# EAGLE design kinesis-model-110 (EAGLE 9.6.2)
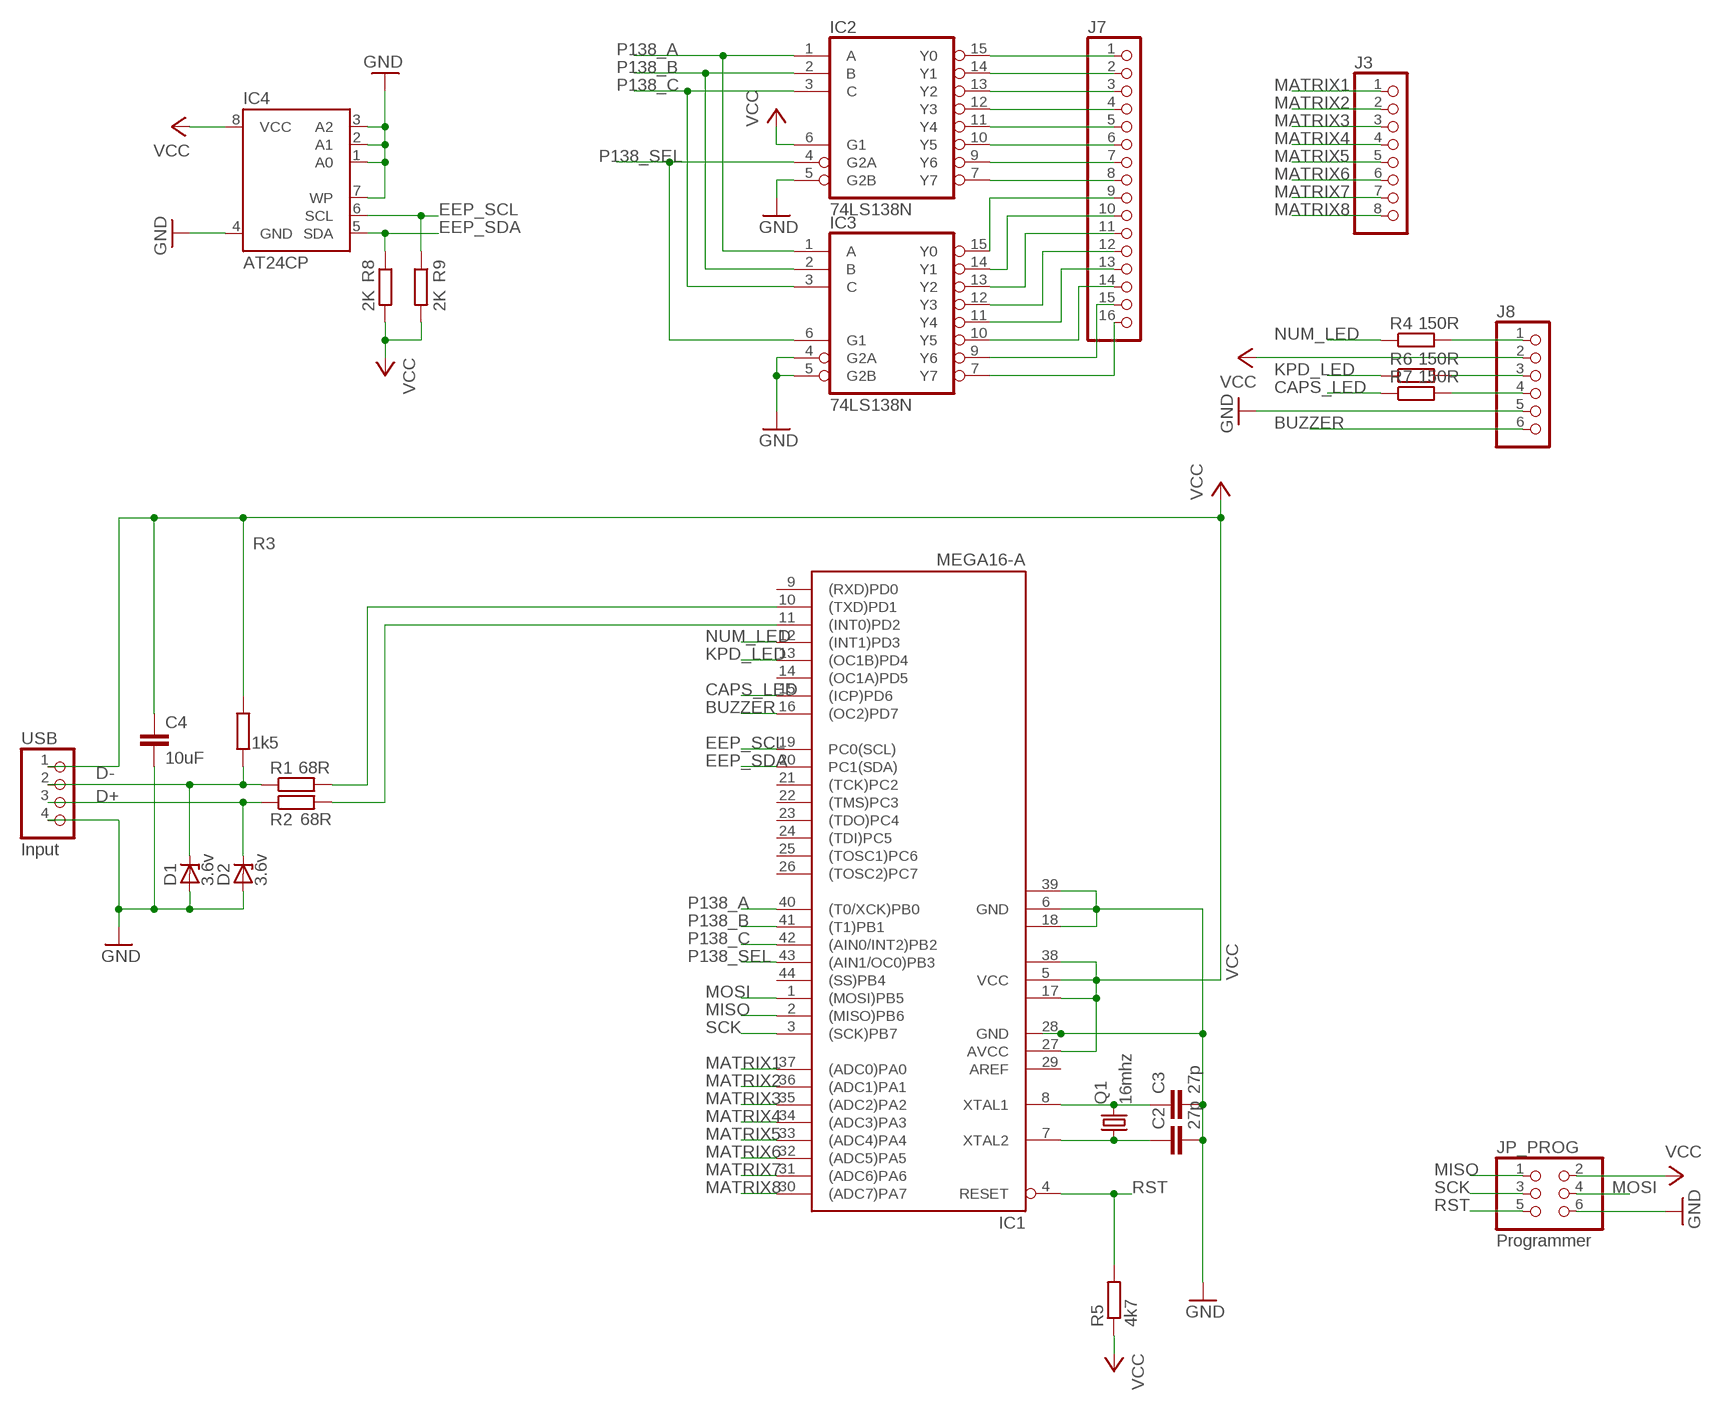
[diagram p0: schematic, sheet 1]

## Parts
C2  27p  C-EUC0603  [C0603]
C3  27p  C-EUC0603  [C0603]
C4  10uF  C-EUC0805  [C0805]
D1  3.6v  ZENER-DIODESOD80C  [SOD80C]
D2  3.6v  ZENER-DIODESOD80C  [SOD80C]
IC1  MEGA16-A  [TQFP44]
IC2  74LS138N  [DIL16]
IC3  74LS138N  [DIL16]
IC4  AT24CP  [DIL08]
J3  PINHD-1X8  [1X08]
J7  PINHD-1X16  [1X16]
J8  PINHD-1X6  [1X06]
JP_PROG  Programmer  PINHD-2X3  [2X03]
Q1  16mhz  CRYSTALHC49S  [HC49/S]
R1  68R  R-EU_R0603  [R0603]
R2  68R  R-EU_R0603  [R0603]
R3  1k5  R-EU_R0603  [R0603]
R4  150R  R-EU_R0603  [R0603]
R5  4k7  R-EU_R0603  [R0603]
R6  150R  R-EU_R0603  [R0603]
R7  150R  R-EU_R0603  [R0603]
R8  2K  R-EU_R0603  [R0603]
R9  2K  R-EU_R0603  [R0603]
USB  Input  PINHD-1X4  [1X04]

## Nets
BUZZER: IC1.16((OC2)PD7) J8.6
CAPS_LED: IC1.15((ICP)PD6) R7.1
CHIP-D+: IC1.11((INT0)PD2) R2.2
CHIP-D-: IC1.10((TXD)PD1) R1.2
D+: D2.C R2.1 USB.3
D-: D1.C R1.1 R3.1 USB.2
EEP_SCL: IC1.19(PC0(SCL)) IC4.6(SCL) R9.1
EEP_SDA: IC1.20(PC1(SDA)) IC4.5(SDA) R8.1
GND: C2.2 C3.2 C4.2 D1.A D2.A IC1.6(GND) IC1.18(GND1) IC1.28(GND) IC1.39(GND2) IC2.5(G2B) IC3.4(G2A) IC3.5(G2B) IC4.1(A0) IC4.2(A1) IC4.3(A2) IC4.4(GND) IC4.7(WP) J8.5 JP_PROG.6 USB.4
KPD_LED: IC1.13((OC1B)PD4) R6.1
MATRIX1: IC1.37((ADC0)PA0) J3.1
MATRIX2: IC1.36((ADC1)PA1) J3.2
MATRIX3: IC1.35((ADC2)PA2) J3.3
MATRIX4: IC1.34((ADC3)PA3) J3.4
MATRIX5: IC1.33((ADC4)PA4) J3.5
MATRIX6: IC1.32((ADC5)PA5) J3.6
MATRIX7: IC1.31((ADC6)PA6) J3.7
MATRIX8: IC1.30((ADC7)PA7) J3.8
MISO: IC1.2((MISO)PB6) JP_PROG.1
MOSI: IC1.1((MOSI)PB5) JP_PROG.4
N$1: IC2.15(Y0) J7.1
N$2: IC2.14(Y1) J7.2
N$3: IC2.13(Y2) J7.3
N$4: IC2.12(Y3) J7.4
N$5: IC2.11(Y4) J7.5
N$6: IC2.10(Y5) J7.6
N$7: IC2.9(Y6) J7.7
N$8: IC2.7(Y7) J7.8
N$9: IC3.15(Y0) J7.9
N$10: IC3.14(Y1) J7.10
N$11: IC3.13(Y2) J7.11
N$12: IC3.12(Y3) J7.12
N$13: IC3.11(Y4) J7.13
N$14: IC3.10(Y5) J7.14
N$15: IC3.9(Y6) J7.15
N$16: IC3.7(Y7) J7.16
N$17: J8.1 R4.2
N$19: J8.3 R6.2
N$20: J8.4 R7.2
NUM_LED: IC1.12((INT1)PD3) R4.1
P138_A: IC1.40((T0/XCK)PB0) IC2.1(A) IC3.1(A)
P138_B: IC1.41((T1)PB1) IC2.2(B) IC3.2(B)
P138_C: IC1.42((AIN0/INT2)PB2) IC2.3(C) IC3.3(C)
P138_SEL: IC1.43((AIN1/OC0)PB3) IC2.4(G2A) IC3.6(G1)
PIN9: C2.1 IC1.7(XTAL2) Q1.1
PIN10: C3.1 IC1.8(XTAL1) Q1.2
RST: IC1.4(RESET) JP_PROG.5 R5.2
SCK: IC1.3((SCK)PB7) JP_PROG.3
VCC: C4.1 IC1.5(VCC) IC1.17(VCC1) IC1.27(AVCC) IC1.38(VCC2) IC2.6(G1) IC4.8(VCC) J8.2 JP_PROG.2 R3.2 R5.1 R8.2 R9.2 USB.1
Unconnected: IC1.9((RXD)PD0) IC1.14((OC1A)PD5) IC1.21((TCK)PC2) IC1.22((TMS)PC3) IC1.23((TDO)PC4) IC1.24((TDI)PC5) IC1.25((TOSC1)PC6) IC1.26((TOSC2)PC7) IC1.29(AREF) IC1.44((SS)PB4)

## Power pins joined to a net without a drawn wire
GND: IC2.8(GND) IC3.8(GND)
VCC: IC2.16(VCC) IC3.16(VCC)

## Library data of the parts
C2-C4 = rcl:C-EU: CAPACITOR, European symbol
D1 D2 = diode:ZENER-DIODE: Z-Diode
IC1 = atmel:MEGA16: MICROCONTROLLER 16 Kbytes FLASH 1 kbytes SRAM 512 bytes EEPROM USART 8-channel 10 bit ADC Source: avr.lbr; MPN: ATMEGA16-16AU; OC_FARNELL: 9171134; OC_NEWARK: 96K6515
IC2 IC3 = 74xx-eu:74*138: 3-line to 8-line DECODER/DEMULTIPLEXER
IC4 = atmel:AT24C*: 2-wire serial EEPROM; MPN: AT24C1024BW-SH-B; OC_FARNELL: 1362646; OC_NEWARK: 03P2044
J3 = pinhead:PINHD-1X8: PIN HEADER
J7 = pinhead:PINHD-1X16: PIN HEADER
J8 = pinhead:PINHD-1X6: PIN HEADER
JP_PROG = pinhead:PINHD-2X3: PIN HEADER
Q1 = crystal:CRYSTAL: CRYSTAL; OC_FARNELL: 1667008; OC_NEWARK: unknown
R1-R9 = rcl:R-EU_: RESISTOR, European symbol
USB = pinhead:PINHD-1X4: PIN HEADER

## Board
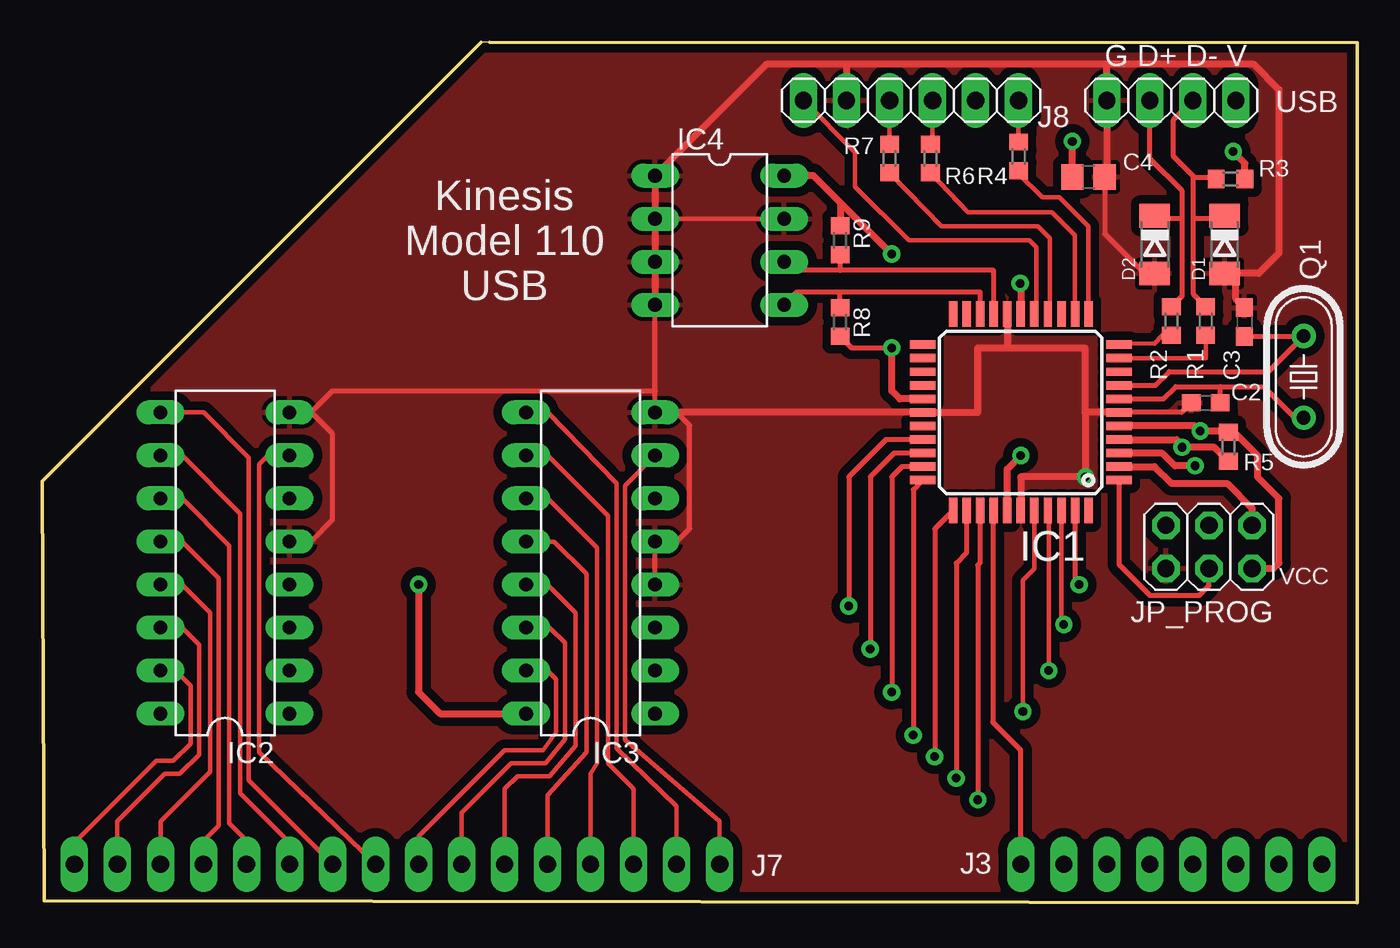
[diagram p1: board, top side]
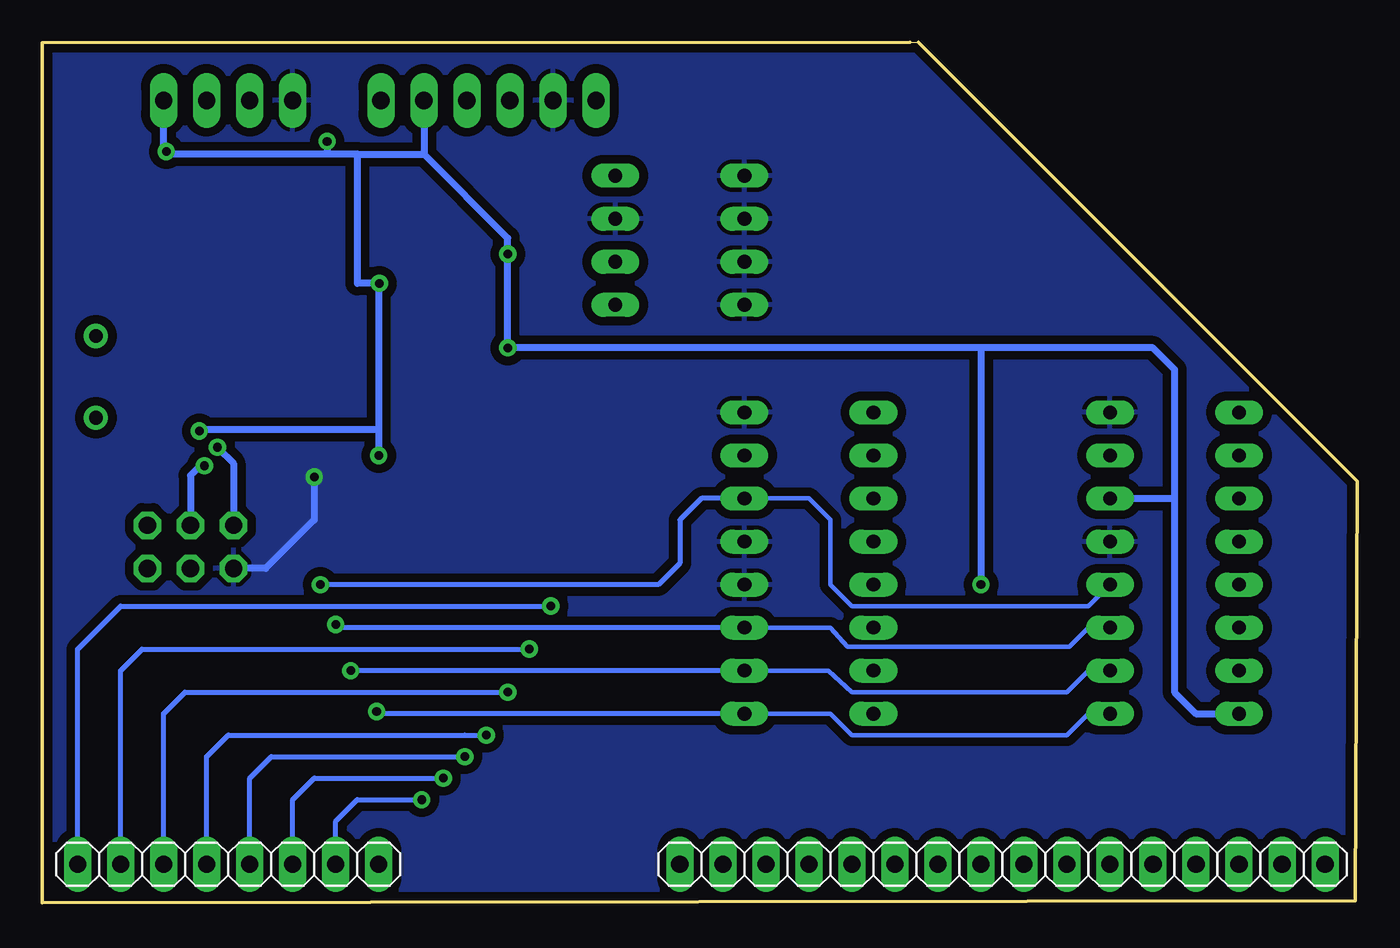
[diagram p2: board, bottom side, seen from below]

Size 77.64 x 50.8 mm. Coordinates in mm from the lower left corner, seen from the top.
Outline: 0.12,0.13 77.64,0 77.64,50.79 26.41,50.8 25.91,50.8 0,24.89 0.12,0.13
Copper layers (1*16): Top 0.035mm / dielectric 1.5mm / Bottom 0.035mm
Design rules "SparkFun": minimum track width 8mil, minimum drill 20mil, track to track 8mil, track to pad 8mil, pad to pad 8mil, via to via 8mil, smd to smd 8mil, copper to edge 10mil, drill to drill 8mil, minimum pad ring 12mil, minimum via ring 10mil, stop-mask expansion 4mil, vias tented up to drill 25mil, thermal gap 10mil

### Footprints (pad centres in the part's own frame; a part is rotated, then mirrored left to right if it is on the bottom)
C0603 = smd 1.1 x 1: 1 -0.85,0; 2 0.85,0
C0805 = smd 1.3 x 1.5: 1 -0.95,0; 2 0.95,0
SOD80C = smd 1.4 x 1.8: A 1.7,0; C -1.7,0
TQFP44 = smd 1.5 x 0.5: 1 -5.8,4; 2 -5.8,3.2; 3 -5.8,2.4; 4 -5.8,1.6; 5 -5.8,0.8; 6 -5.8,0; 7 -5.8,-0.8; 8 -5.8,-1.6; 9 -5.8,-2.4; 10 -5.8,-3.2; 11 -5.8,-4; 23 5.8,-4; 24 5.8,-3.2; 25 5.8,-2.4; 26 5.8,-1.6; 27 5.8,-0.8; 28 5.8,0; 29 5.8,0.8; 30 5.8,1.6; 31 5.8,2.4; 32 5.8,3.2; 33 5.8,4 | smd 0.5 x 1.5: 12 -4,-5.8; 13 -3.2,-5.8; 14 -2.4,-5.8; 15 -1.6,-5.8; 16 -0.8,-5.8; 17 0,-5.8; 18 0.8,-5.8; 19 1.6,-5.8; 20 2.4,-5.8; 21 3.2,-5.8; 22 4,-5.8; 34 4,5.8; 35 3.2,5.8; 36 2.4,5.8; 37 1.6,5.8; 38 0.8,5.8; 39 0,5.8; 40 -0.8,5.8; 41 -1.6,5.8; 42 -2.4,5.8; 43 -3.2,5.8; 44 -4,5.8
DIL16 = drill 0.813 long: 1 -8.89,-3.81; 2 -6.35,-3.81; 3 -3.81,-3.81; 4 -1.27,-3.81; 5 1.27,-3.81; 6 3.81,-3.81; 7 6.35,-3.81; 8 8.89,-3.81; 9 8.89,3.81; 10 6.35,3.81; 11 3.81,3.81; 12 1.27,3.81; 13 -1.27,3.81; 14 -3.81,3.81; 15 -6.35,3.81; 16 -8.89,3.81
DIL08 = drill 0.813 long: 1 -3.81,-3.81; 2 -1.27,-3.81; 3 1.27,-3.81; 4 3.81,-3.81; 5 3.81,3.81; 6 1.27,3.81; 7 -1.27,3.81; 8 -3.81,3.81
1X08 = drill 1.016 long: 1 -8.89,0; 2 -6.35,0; 3 -3.81,0; 4 -1.27,0; 5 1.27,0; 6 3.81,0; 7 6.35,0; 8 8.89,0
1X16 = drill 1.016 long: 1 -19.05,0; 2 -16.51,0; 3 -13.97,0; 4 -11.43,0; 5 -8.89,0; 6 -6.35,0; 7 -3.81,0; 8 -1.27,0; 9 1.27,0; 10 3.81,0; 11 6.35,0; 12 8.89,0; 13 11.43,0; 14 13.97,0; 15 16.51,0; 16 19.05,0
1X06 = drill 1.016 long: 1 -6.35,0; 2 -3.81,0; 3 -1.27,0; 4 1.27,0; 5 3.81,0; 6 6.35,0
2X03 = drill 1.016 octagon: 1 -2.54,-1.27; 2 -2.54,1.27; 3 0,-1.27; 4 0,1.27; 5 2.54,-1.27; 6 2.54,1.27
HC49/S = drill 0.813: 1 -2.413,0; 2 2.413,0
R0603 = smd 1 x 1.1: 1 -0.85,0; 2 0.85,0
1X04 = drill 1.016 long: 1 -3.81,0; 2 -1.27,0; 3 1.27,0; 4 3.81,0

### Placement (x,y rotation side)
C2  68.7,29.53 180 top
C3  70.98,34.29 90 top
C4  61.78,42.86 0 top
D1  69.81,38.86 270 top
D2  65.69,38.86 270 top
IC1  57.77,28.96 180 top
IC2  10.79,20.07 90 top
IC3  32.38,20.07 90 top
IC4  40,39.12 270 top
J3  66.66,2.29 180 bottom
J7  20.95,2.29 180 bottom
J8  51.3,47.37 180 top
JP_PROG  68.89,21.02 180 top
Q1  74.48,31.05 90 top
R1  68.7,34.35 270 top
R2  66.66,34.35 270 top
R3  70.16,42.74 0 top
R4  57.65,44.07 90 top
R5  70.03,26.92 270 top
R6  52.44,43.94 90 top
R7  50.03,43.94 90 top
R8  47.11,34.29 270 top
R9  47.11,39.12 90 top
USB  66.66,47.37 180 top

### Tracks (layer width: path | path; a pad name or v marks a point on that pad's centre or on a via)
BUZZER
  Top 0.254: J8.6 48,44.32 48,42.29 51.17,39.12 58.28,39.12 58.7,38.7 58.7,34.88 IC1.16
CAPS_LED
  Top 0.254: IC1.15 59.5,34.88 59.5,39.23 58.79,39.94 53.08,39.94 R7.1
CHIP-D+
  Top 0.254: R2.2 66.13,33.5 65.65,33.02 63.66,33.03 IC1.11
CHIP-D-
  Top 0.254: R1.2 68.7,32.16 IC1.10
D+
  Top 0.305: R2.1 67.3,35.84 67.3,40.39 | 67.3,40.39 67.3,42.04 65.39,43.94 USB.3 | 67.3,40.39 65.86,40.39 D2.C
D-
  Top 0.305: R3.1 69.22,42.82 68.04,42.82 67.94,42.93 | R1.1 67.94,35.97 67.94,40.39 | 67.94,42.93 67.94,40.39 | D1.C 69.64,40.39 67.94,40.39 | 67.94,42.93 66.79,44.07 66.79,46.23 USB.2
EEP_SCL
  Top 0.305: IC1.19 56.18,37.34 47.11,37.34 | IC4.6 44.31,37.34 47.11,37.34 | R9.1 47.11,37.34
EEP_SDA
  Top 0.305: 47.11,36.07 44.57,36.07 IC4.5 | 47.11,36.07 55.38,36.07 IC1.20 | R8.1 47.11,36.07
GND  (via drill 0.51)
  Top 0.254: IC4.7 IC4.2
  Top 0.305: IC3.4 IC3.5 37.46,21.34 38.22,22.1 38.22,28.19 37.46,28.96 IC3.8 36.19,30.23 | 36.19,30.23 IC4.4 | IC2.8 15.86,28.96 | 15.86,28.96 17.13,30.23 36.19,30.23 | IC2.5 15.86,21.34 17.13,22.61 17.13,27.69 15.86,28.96 | C2.2 67.27,28.96 IC1.6 | C4.2 62.73,39.5 65.06,37.16 D2.A
  Top 0.406: IC1.18 56.98,32.77 | 56.98,32.77 61.59,32.77 61.59,28.96 | IC1.6 61.59,28.96 | 61.59,28.96 v61.59,25.15 57.77,25.15 IC1.39 | 56.98,32.77 55.23,32.77 55.23,28.96 IC1.28 IC3.8 | 47.49,49.53 J8.5 | IC4.4 IC4.3 IC4.2 IC4.1 42.79,49.53 47.49,49.53 | C3.2 70.47,35.65 70.47,37.16 D1.A 71.82,37.16 73.02,38.35 73.02,48.01 71.49,49.53 62.85,49.53 | C4.2 62.85,42.73 USB.4 62.85,49.53 | 47.49,49.53 62.85,49.53
  Bottom 0.406: v61.59,25.15 61.59,22.61 64.44,19.75 JP_PROG.6
  pour Top (isolate 0.508): 77.33,0.13 0.24,0.13 0.24,24.77 26.03,50.55 77.33,50.55
  pour Bottom (isolate 0.508): 77.33,0.13 0.24,0.13 0.24,24.77 26.15,50.67 77.33,50.67
KPD_LED
  Top 0.254: IC1.13 60.98,39.41 59.62,40.77 54.67,40.77 R6.1
MATRIX1
  Top 0.305: IC1.37 56.12,23.11 56.12,10.67 57.77,9.02 J3.1
MATRIX2  (via drill 0.51)
  Top 0.305: IC1.36 55.38,20.08 55.23,19.94 v55.23,6.1
  Bottom 0.305: J3.2 60.32,4.83 59.05,6.1 v55.23,6.1
MATRIX3  (via drill 0.51)
  Top 0.305: IC1.35 54.58,20.68 53.97,20.07 v53.97,7.37
  Bottom 0.305: J3.3 62.85,6.1 61.59,7.37 v53.97,7.37
MATRIX4  (via drill 0.51)
  Top 0.305: IC1.34 52.7,22.08 v52.7,8.64
  Bottom 0.305: J3.4 65.39,7.37 64.12,8.64 v52.7,8.64
MATRIX5  (via drill 0.51)
  Top 0.305: IC1.33 51.43,24.41 v51.43,9.91
  Bottom 0.305: J3.5 67.94,8.64 66.66,9.91 52.7,9.91 v51.43,9.91
MATRIX6  (via drill 0.51)
  Top 0.305: IC1.32 50.77,25.76 50.16,25.15 v50.16,12.45
  Bottom 0.305: J3.6 70.47,11.18 69.2,12.45 v50.16,12.45
MATRIX7  (via drill 0.51)
  Top 0.305: IC1.31 50.3,26.56 48.89,25.15 v48.89,14.99
  Bottom 0.305: J3.7 73.02,13.72 71.74,14.99 v48.89,14.99
MATRIX8  (via drill 0.51)
  Top 0.305: IC1.30 49.83,27.36 47.62,25.15 v47.62,17.53
  Bottom 0.305: J3.8 75.55,14.99 73.02,17.53 v47.62,17.53
MISO
  Top 0.406: IC1.2 65.68,25.76 66.67,24.77 69.97,24.77 71.43,23.3 JP_PROG.1
MOSI
  Top 0.305: IC1.1 63.57,19.98 65.39,18.16 68.32,18.16 68.89,18.73 JP_PROG.4
N$1
  Top 0.254: J7.1 1.9,3.56 6.72,8.38 7.74,8.38 8.75,9.4 8.75,12.83 7.86,13.72 IC2.15
N$2
  Top 0.254: J7.2 4.43,4.83 7.23,7.62 8.12,7.62 9.26,8.76 9.26,15.24 8.25,16.26 IC2.14
N$3
  Top 0.254: J7.3 6.98,4.83 9.9,7.75 9.9,17.14 8.25,18.8 IC2.13
N$4
  Top 0.254: J7.4 9.52,3.68 10.4,4.57 10.4,19.18 8.25,21.34 IC2.12
N$5
  Top 0.254: J7.5 12.05,3.68 11.04,4.7 11.04,21.08 8.25,23.88 IC2.11
N$6
  Top 0.254: J7.6 14.59,3.56 11.67,6.48 11.67,22.99 8.25,26.42 IC2.10
N$7
  Top 0.254: J7.7 12.18,7.24 12.18,26.29 9.52,28.96 IC2.9
N$8
  Top 0.254: J7.8 12.82,8.89 12.82,25.91 13.32,26.42 IC2.7
N$9
  Top 0.254: J7.9 22.21,3.94 27.29,9.02 29.58,9.02 30.34,10.08 30.34,13.21 29.83,13.72 IC3.15
N$10
  Top 0.254: J7.10 24.75,5.33 27.68,8.26 29.71,8.26 30.85,9.65 30.85,15.37 29.96,16.26 IC3.14
N$11
  Top 0.254: J7.11 27.29,6.73 28.06,7.49 29.96,7.49 31.49,9.27 31.49,17.14 29.83,18.8 IC3.13
N$12
  Top 0.254: IC3.12 30.22,21.34 32.12,19.43 32.12,8.89 29.83,6.35 J7.12
N$13
  Top 0.254: IC3.11 29.83,23.88 32.76,20.96 32.76,8.26 32.38,7.62 J7.13
N$14
  Top 0.254: IC3.10 29.83,26.42 33.39,22.86 33.39,8.26 34.91,6.73 J7.14
N$15
  Top 0.254: J7.15 37.46,5.71 33.9,9.14 33.9,24.77 29.83,28.96 IC3.9
N$16
  Top 0.254: IC3.7 34.41,24.64 34.41,9.63 40,4.83 J7.16
N$17
  Top 0.254: J8.1 R4.2
N$19
  Top 0.254: R6.2 52.57,45.02 J8.3
N$20
  Top 0.254: R7.2 J8.4
NUM_LED
  Top 0.254: IC1.12 61.77,39.94 60.06,41.66 59.05,41.66 57.65,43.05 R4.1 | IC1.12
P138_A  (via drill 0.51)
  Top 0.254: v57.9,11.3 57.9,19.05 58.57,19.72 IC1.40
  Bottom 0.254: IC2.1 15.86,11.18 17.13,9.91 29.83,9.91 31.11,11.18 IC3.1
  Bottom 0.305: IC3.1 57.77,11.18 v57.9,11.3
P138_B  (via drill 0.51)
  Top 0.254: IC1.41 59.43,23.11 v59.43,13.72
  Bottom 0.254: IC2.2 15.86,13.72 17.13,12.45 29.83,12.45 31.23,13.72 IC3.2
  Bottom 0.305: IC3.2 v59.43,13.72
P138_C  (via drill 0.51)
  Top 0.254: IC1.42 60.18,16.81 60.32,16.67 v60.32,16.43
  Bottom 0.254: IC2.3 15.86,16.26 17.01,15.11 30.09,15.11 31.11,16.26 IC3.3
  Bottom 0.305: IC3.3 60.14,16.26 v60.32,16.43
P138_SEL  (via drill 0.51)
  Top 0.305: IC1.43 60.98,19.04 v61.22,18.79
  Bottom 0.254: IC2.4 15.86,17.53 29.83,17.53 31.11,18.8 31.11,22.61 32.38,23.88 IC3.6
  Bottom 0.305: IC3.6 38.73,23.88 40,22.61 40,20.07 41.27,18.8 42.54,18.8 42.54,18.79 v61.22,18.79
PIN9
  Top 0.305: IC1.7 66.19,29.76 66.92,30.48 69.59,30.48 | 69.59,30.48 72.13,30.48 73.97,28.64 Q1.1 | C2.1 69.55,30.44 69.59,30.48
PIN10
  Top 0.305: IC1.8 65.72,30.56 66.54,31.37 72.38,31.37 Q1.2 74.45,33.44 C3.1
RST  (via drill 0.51)
  Top 0.406: IC1.4 66.97,27.36 67.3,27.03 v67.3,26.9 69.21,26.9 R5.2
  Bottom 0.406: v67.3,26.9 66.35,25.95 JP_PROG.5
SCK  (via drill 0.51)
  Top 0.254: IC1.3 63.59,26.54
  Top 0.406: 63.59,26.54 66.14,26.54 66.88,25.81 v68.06,25.81
  Bottom 0.406: v68.06,25.81 68.32,25.81 68.89,25.24 JP_PROG.3
VCC  (via drill 0.51)
  Top 0.305: R8.2 47.78,32.77 v50.16,32.77
  Top 0.406: IC1.27 50.62,29.76 50.16,30.23 v50.16,32.77 | IC1.38 56.98,25.62 v57.77,26.42 | IC1.5 68.08,28.16 v68.37,27.86 69.64,27.86 69.73,27.77 R5.1 70.39,27.77 71.74,26.42 71.74,25.15 73.02,23.88 73.02,20.07 72.7,19.75 JP_PROG.2 | v22.21,18.8 22.21,12.45 23.48,11.18 IC3.16 | R3.2 71.01,43.66 v70.32,44.36 | v50.16,38.3 47.15,41.31 | 47.15,41.31 45.53,42.93 IC4.8 | R9.2 47.15,40 47.15,41.31 | v57.74,36.58 57.77,36.54 IC1.17 | C4.1 v60.82,44.96
  Bottom 0.406: 10.79,23.88 10.79,31.5 12.05,32.77 22.21,32.77 | IC2.6 10.79,23.88 | J8.2 55.11,44.2 | 59.05,44.2 55.11,44.2 | 22.21,32.77 v50.16,32.77 v50.16,38.3 50.16,39.24 55.11,44.2 | 57.77,27.94 v57.77,26.42 | 57.77,27.94 68.37,27.94 v68.37,27.86 | 22.21,32.77 v22.21,18.8 | 10.79,23.88 10.79,12.45 9.52,11.18 IC2.16 | 59.05,44.2 60.95,44.2 | 60.95,44.2 70.16,44.2 v70.32,44.36 70.47,44.51 USB.1 | 59.05,44.2 59.05,36.58 57.77,36.58 | 57.77,36.58 57.77,27.94 | v60.82,44.96 60.82,44.32 60.95,44.2 | v57.74,36.58 57.77,36.58

### Text on the board
tPlace: G D+ D- V | Kinesis / Model 110 / USB
tNames: VCC